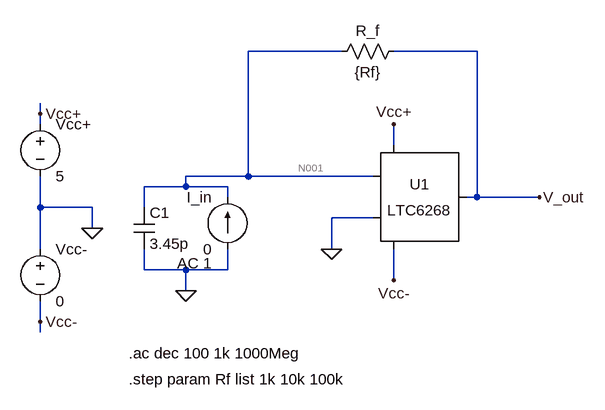
[diagram p0: schematic tia.asc]
tia.asc, the LTspice schematic file:
Version 4
SHEET 1 1264 784
WIRE 480 208 336 208
WIRE 688 208 560 208
WIRE 16 304 16 288
WIRE 16 320 16 304
WIRE 560 352 560 320
WIRE 336 400 336 208
WIRE 336 400 240 400
WIRE 528 400 336 400
WIRE 240 416 240 400
WIRE 240 416 176 416
WIRE 304 416 240 416
WIRE 304 432 304 416
WIRE 688 432 688 208
WIRE 688 432 672 432
WIRE 784 432 688 432
WIRE 16 448 16 400
WIRE 96 448 16 448
WIRE 176 448 176 416
WIRE 528 464 464 464
WIRE 96 480 96 448
WIRE 16 512 16 448
WIRE 464 512 464 464
WIRE 176 544 176 512
WIRE 240 544 176 544
WIRE 304 544 304 512
WIRE 304 544 240 544
WIRE 560 560 560 512
WIRE 240 576 240 544
WIRE 16 624 16 592
WIRE 16 640 16 624
FLAG 240 576 0
FLAG 96 480 0
FLAG 16 304 Vcc+
FLAG 16 624 Vcc-
FLAG 560 320 Vcc+
FLAG 560 560 Vcc-
FLAG 784 432 V_out
FLAG 464 512 0
SYMBOL current 304 512 R180
WINDOW 0 24 80 Left 2
WINDOW 3 24 0 Left 2
WINDOW 123 24 -22 Left 2
SYMATTR InstName I_in
SYMATTR Value 0
SYMATTR Value2 AC 1
SYMBOL voltage 16 304 R0
SYMATTR InstName Vcc+
SYMATTR Value 5
SYMBOL voltage 16 496 R0
SYMATTR InstName Vcc-
SYMATTR Value 0
SYMBOL cap 160 448 R0
SYMATTR InstName C1
SYMATTR Value 3.45p
SYMBOL OpAmps/LTC6268 560 432 R0
SYMATTR InstName U1
SYMBOL Res 576 192 R90
WINDOW 0 0 56 VBottom 2
WINDOW 3 32 56 VTop 2
SYMATTR InstName R_f
SYMATTR Value {Rf}
TEXT 152 672 Left 2 !.ac dec 100 1k 1000Meg
TEXT 152 712 Left 2 !.step param Rf list 1k 10k 100k

The netlist it stands for:
* tia.asc
I_in 0 N001 0 AC 1
Vcc+ Vcc+ 0 5
Vcc- 0 Vcc- 0
C1 N001 0 3.45p
XU1 0 N001 V_out Vcc+ Vcc- NC_01 LTC6268
R_f V_out N001 {Rf}
.ac dec 100 1k 1000Meg
.step param Rf list 1k 10k 100k
.lib LTC2.lib
.backanno
.end

* Results of the author's LTspice run, read from the files saved beside the schematic
* Operating Point (first step), zero values left out:
*   rf = 1 k
*   V(n001) = 429.2 µV
*   V(vcc+) = 5 V
*   V(v_out) = 429.2 µV
*   I(Vcc+) = -6.014 mA
*   I(Vcc-) = -6.014 mA
*   Ix(u1:3) = 4.999 pA
*   Ix(u1:4) = 6.014 mA
*   Ix(u1:5) = -6.014 mA
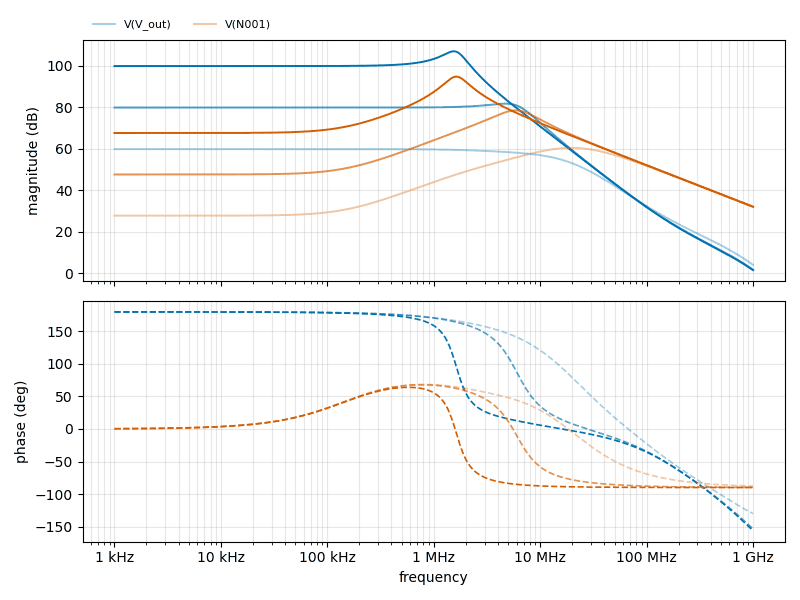
[diagram p1: AC Analysis of tia.asc, plotted from the saved traces]
* AC Analysis, 3 runs:
*   V(V_out) [rf=1000]: 59.79 dB at 1 kHz, 3.96 dB at 1 GHz, peak 59.79 dB at 1 kHz, 3 dB below the peak at 10.21 MHz
*   V(V_out) [rf=10000]: 79.79 dB at 1 kHz, 1.62 dB at 1 GHz, peak 81.68 dB at 4.786 MHz, 3 dB below the peak at 7.15 MHz
*   V(V_out) [rf=100000]: 99.79 dB at 1 kHz, 1.43 dB at 1 GHz, peak 106.92 dB at 1.549 MHz, 3 dB below the peak at 1.088 MHz and 1.905 MHz
*   V(N001) [rf=1000]: 27.69 dB at 1 kHz, 31.98 dB at 1 GHz, peak 60.38 dB at 19.5 MHz, 3 dB below the peak at 7.875 MHz and 46.35 MHz
*   V(N001) [rf=10000]: 47.55 dB at 1 kHz, 31.99 dB at 1 GHz, peak 78.46 dB at 5.888 MHz, 3 dB below the peak at 3.714 MHz and 8.879 MHz
*   V(N001) [rf=100000]: 67.53 dB at 1 kHz, 32.00 dB at 1 GHz, peak 94.71 dB at 1.622 MHz, 3 dB below the peak at 1.285 MHz and 2.057 MHz